# Altium schematic sheet PS.SchDoc
size A4; SheetNumber: 3; SheetTotal: 4; SPICEModelCacheHBBZFCVO: <root> / <DocumentId>HBBZFCVO</DocumentId> / <CacheFrame Number="0"> / <Model Name="1n4004" Kind="MDL"> / <Text>*1N4004 MCE 8-16-95 / *400V 1A Si GenPurpose Diode pkg:DIODE0.4 1,2 / .MODEL 1N4004 D(IS=2.55E-9 RS=0.042 N=1.75 TT=5.76E-6 CJO=1.85E-11 / + VJ=0.75 M=0.333 BV=400 IBV=3.95E-5 )</Text> / </Model> / </CacheFrame> / </root>
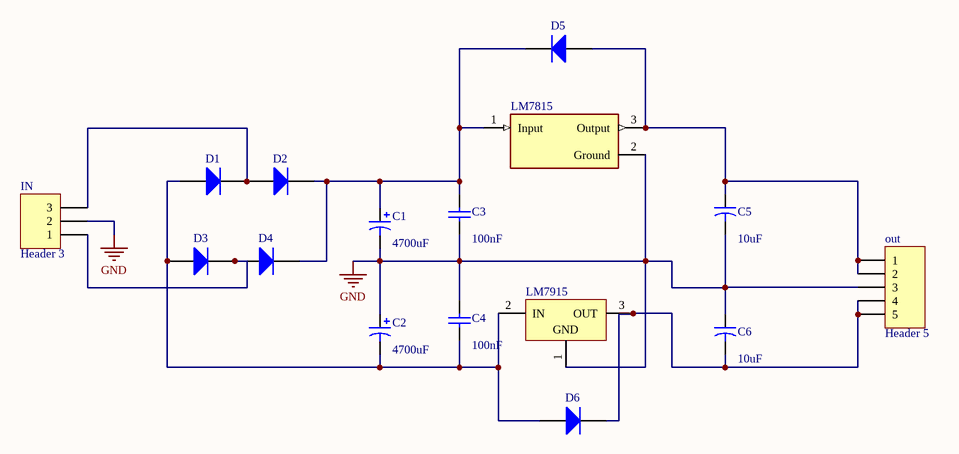
[diagram p0: PS.SchDoc]

## Parts
C1  value 4700uF  [RB7.6-15]  (hidden comment: Cap Pol1)
C2  value 4700uF  [RB7.6-15]  (hidden comment: Cap Pol1)
C3  value 100nF  [RAD-0.3]  (hidden comment: Cap)
C4  value 100nF  [RAD-0.3]  (hidden comment: Cap)
C5  value 10uF  [CAPR5-4X5]  (hidden comment: Cap2)
C6  value 10uF  [CAPR5-4X5]  (hidden comment: Cap2)
D1  Diode 1N4004  [DO-41]  (value not drawn)
D2  Diode 1N4004  [DO-41]  (value not drawn)
D3  Diode 1N4004  [DO-41]  (value not drawn)
D4  Diode 1N4004  [DO-41]  (value not drawn)
D5  Diode 1N4004  [DO-41]  (value not drawn)
D6  Diode 1N4004  [DO-41]  (value not drawn)
IN  Header 3  [HDR1X3]
LM7815  LM7815  [FP-NDE0003B-MFG]  (value not drawn)
LM7915  LM7915  [NDE0003A]  (value not drawn)
out  Header 5  [HDR1X5]

## Nets
GND: C1.2 C2.1 C3.1 C4.2 C5.2 C6.1 IN.2 LM7815.2(Ground) LM7915.1(GND) out.3
NetC1_1: C1.1 C3.2 D2.2(K) D4.2(K) D5.2(K) LM7815.1(Input)
NetC2_2: C2.2 C4.1 D1.1(A) D3.1(A) D6.1(A) LM7915.2(IN)
NetC5_1: C5.1 D5.1(A) LM7815.3(Output) out.1 out.2
NetC6_2: C6.2 D6.2(K) LM7915.3(OUT) out.4 out.5
NetD1_2: D1.2(K) D2.1(A) IN.3
NetD3_2: D3.2(K) D4.1(A) IN.1

## Library data of the parts
C1 C2 = Cap Pol1: Polarized Capacitor (Radial); Published: 8-Jun-2000; LatestRevisionDate: 17-Jul-2002; LatestRevisionNote: Re-released for DXP Platform.; PackageReference: RB7.6-15; Publisher: Altium Limited; PackageDescription: Polarized Capacitor (Radial); 2 Leads
C3 C4 = Cap: Capacitor; Published: 8-Jun-2000; LatestRevisionDate: 17-Jul-2002; LatestRevisionNote: Re-released for DXP Platform.; PackageReference: RAD-0.3; Publisher: Altium Limited; PackageDescription: Radial Cap, Thru-Hole; 2 Leads; 0.3 in Pin Spacing
C5 C6 = Cap2: Capacitor; Published: 23-Sep-2002; PackageReference: CAPR5-4X5; Publisher: Altium Limited; PackageDescription: Capacitor; 2 Leads
D1-D6 = Diode 1N4004: 1 Amp General Purpose Rectifier; Published: 8-Jun-2000; LatestRevisionDate: 17-Jul-2002; LatestRevisionNote: Re-released for DXP Platform.; DatasheetVersion: 1998; PackageVersion: Aug-1999; PackageReference: DO-41; Publisher: Altium Limited; PackageDescription: Diode, Axial; Body 5.2 x 2.7 mm (LxDia. max), Lead Dia. 0.86 mm (max); Code_JEDEC: DO-204-AL; ComponentLink1Description: Manufacturer Link; ComponentLink1URL: http://www.fairchildsemi.com/; ComponentLink2Description: Datasheet; ComponentLink2URL: http://www.fairchildsemi.com/ds/1N%2F1N4001.pdf
IN = Header 3: Header, 3-Pin; LatestRevisionDate: 17-Jul-2002; LatestRevisionNote: Re-released for DXP Platform.; Publisher: Altium Limited
LM7815 = CMP-04917-000014-1: pin 1 in / pin 2 GND / pin 3 out; Manufacturer Part Number: LM7815CT/NOPB; Manufacturer: Texas Instruments; Accuracy Percentage: 3%; Nominal Supply Current: 8mA; Standoff Height: 3.3mm; Min Supply Voltage: 7.5V; Number Of Outputs: 1; Max Supply Voltage: 30V; Output Voltage: 15V; Dropout Voltage: 2V; Output Current: 1.5A; Output Type: Fixed; Max Junction Temp: +150°C; Device Class L2: Power Management ICs; Temperature: 0°C to +125°C; Automotive: No; ComponentLink2URL: http://www.ti.com/lit/ds/symlink/lm7800.pdf; Lead Free: Yes; Temperature Range High: +125°C; Digikey Description: IC REG LINEAR 15V 1A TO220-3; Package: NDE0003B; Ipc Land Pattern Name: TO-220; Category: IC; Device Class L3: Voltage Regulators - Linear; RoHS: TRUE; ComponentLink2Description: Datasheet; Height: 19.55mm; Temperature Range Low: 0°C; Device Class L1: Integrated Circuits (ICs); Mouser Description: Linear Voltage Regulators 15 Volt Reg; Octopart: https://octopart.com/lm7815ct%2Fnopb-texas+instruments-23919376
LM7915 = CMP-0062-02469-3: pin 3 out / pin 2 in / pin 1 GND; Manufacturer: Texas Instruments; PackageTopMarking: NSUZXYTTE#*LM7915CT; PowerWise: N; CompType: LDO IC; PackageReference: NDE0003A; PackageDescription: TO-220, Molded, 3 Lead, Straight; ComponentLink1Description: Datasheet URL; PinCount: 3; RoHS: Y; ComponentLink1URL: http://www.ti.com/general/docs/lit/getliterature.tsp?genericPartNumber=LM7915&fileType=pdf
out = Header 5: Header, 5-Pin; LatestRevisionDate: 17-Jul-2002; LatestRevisionNote: Re-released for DXP Platform.; Publisher: Altium Limited